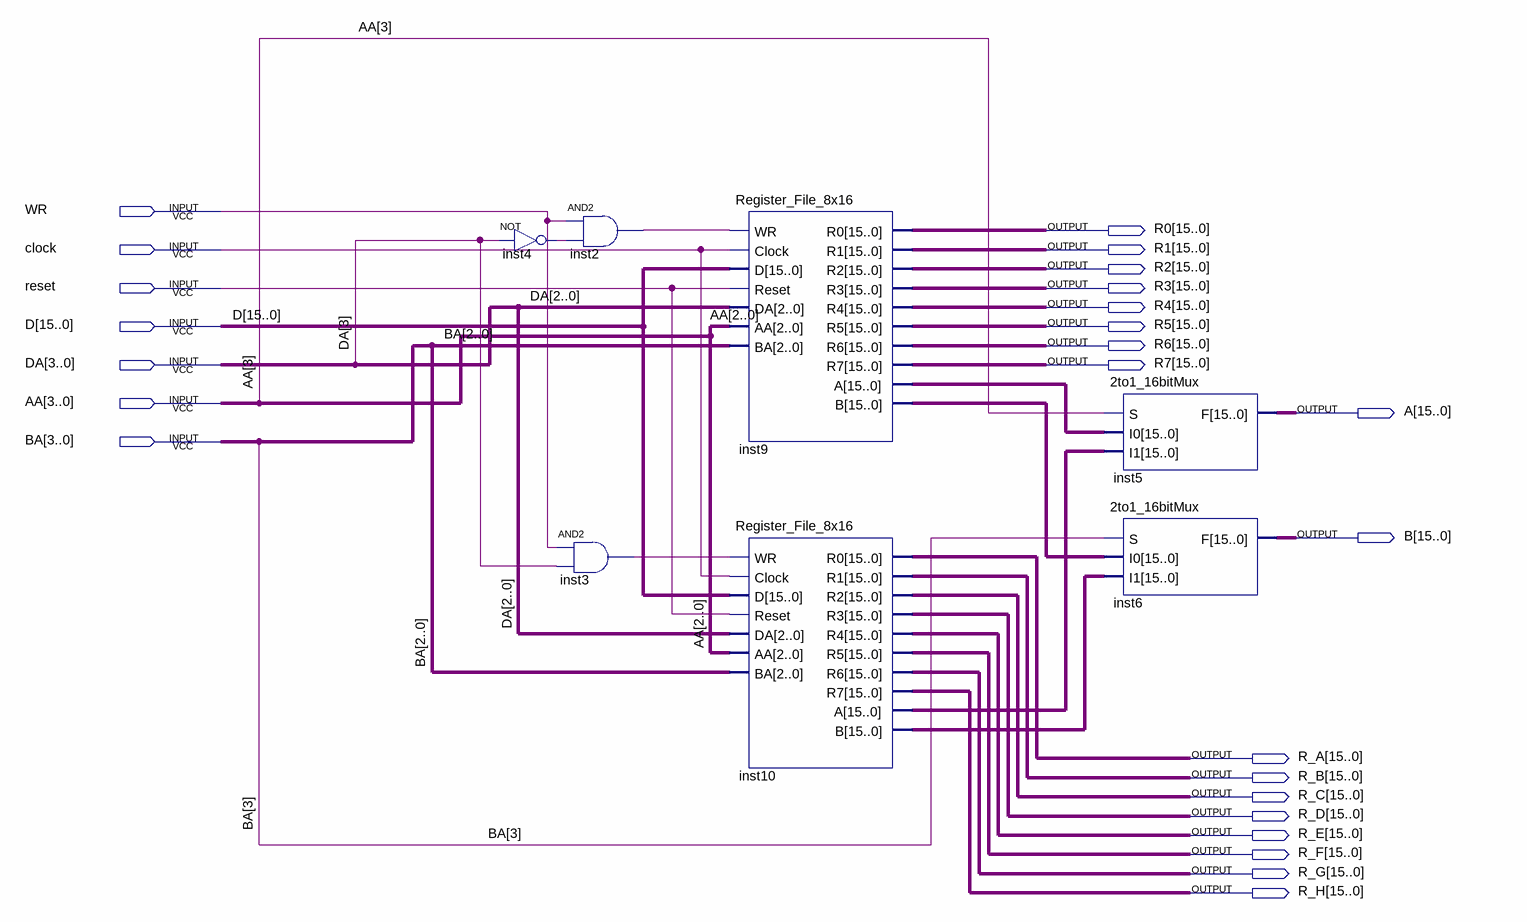
[diagram p0: schematic sheet]
// Quartus schematic 16x16_Register_File.bdf as structural Verilog: 7 symbols, 25 pins
module \16x16_Register_File  (
  input  WR,
  input  clock,
  input  reset,
  input  [15:0] D,
  input  [3:0] DA,
  input  [3:0] AA,
  input  [3:0] BA,
  output [15:0] R0,
  output [15:0] R1,
  output [15:0] R2,
  output [15:0] R3,
  output [15:0] R4,
  output [15:0] R5,
  output [15:0] R6,
  output [15:0] R7,
  output [15:0] A,
  output [15:0] B,
  output [15:0] R_A,
  output [15:0] R_B,
  output [15:0] R_C,
  output [15:0] R_D,
  output [15:0] R_E,
  output [15:0] R_F,
  output [15:0] R_G,
  output [15:0] R_H
);

  wire inst2_out, inst3_out, inst4_out;
  wire [15:0] inst9_a, inst9_b, inst10_a, inst10_b;

  not inst4 (inst4_out, DA[3]);
  and inst2 (inst2_out, WR, inst4_out);
  and inst3 (inst3_out, WR, DA[3]);
  Register_File_8x16 inst9 (
    .Reset(reset), .D(D), .Clock(clock), .WR(inst2_out), .DA(DA[2:0]), .AA(AA[2:0]), .BA(BA[2:0]), .R0(R0),
    .R1(R1), .R2(R2), .R3(R3), .R4(R4), .R5(R5), .R6(R6), .R7(R7), .A(inst9_a), .B(inst9_b));
  Register_File_8x16 inst10 (
    .Reset(reset), .D(D), .Clock(clock), .WR(inst3_out), .DA(DA[2:0]), .AA(AA[2:0]), .BA(BA[2:0]), .R0(R_A),
    .R1(R_B), .R2(R_C), .R3(R_D), .R4(R_E), .R5(R_F), .R6(R_G), .R7(R_H), .A(inst10_a), .B(inst10_b));
  \2to1_16bitMux  inst5 (.S(AA[3]), .I0(inst9_a), .I1(inst10_a), .F(A));
  \2to1_16bitMux  inst6 (.S(BA[3]), .I0(inst9_b), .I1(inst10_b), .F(B));
endmodule
